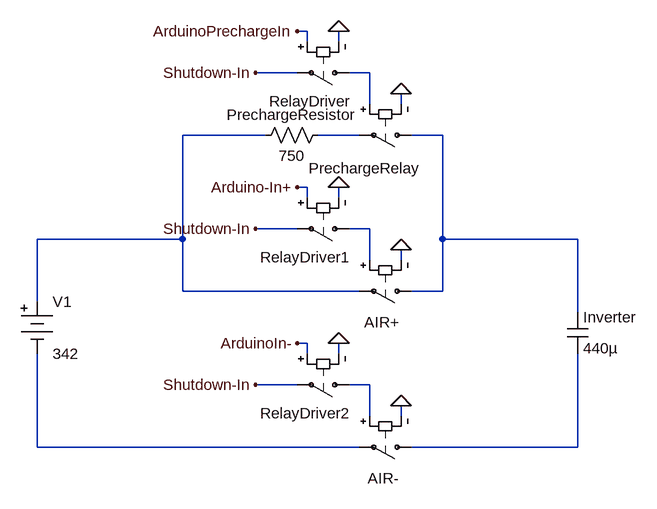
[diagram p0: schematic System Schematic.asc]
System Schematic.asc, the LTspice schematic file:
Version 4
SHEET 1 880 796
WIRE 160 -64 144 -64
WIRE 160 -48 160 -64
WIRE 208 -48 208 -64
WIRE 144 0 80 0
WIRE 256 0 224 0
WIRE 256 48 256 0
WIRE 304 48 304 32
WIRE 96 96 -32 96
WIRE 240 96 176 96
WIRE 368 96 320 96
WIRE 160 176 144 176
WIRE 160 192 160 176
WIRE 208 192 208 176
WIRE 144 240 80 240
WIRE 256 240 224 240
WIRE -32 256 -32 96
WIRE -32 256 -256 256
WIRE 368 256 368 96
WIRE 576 256 368 256
WIRE 256 288 256 240
WIRE 304 288 304 272
WIRE -32 336 -32 256
WIRE 240 336 -32 336
WIRE 368 336 368 256
WIRE 368 336 320 336
WIRE -256 352 -256 256
WIRE 576 368 576 256
WIRE 160 416 144 416
WIRE 160 432 160 416
WIRE 208 432 208 416
WIRE 144 480 80 480
WIRE 256 480 224 480
WIRE 256 528 256 480
WIRE 304 528 304 512
WIRE -256 576 -256 432
WIRE 240 576 -256 576
WIRE 576 576 576 432
WIRE 576 576 320 576
FLAG 144 -64 ArduinoPrechargeIn
FLAG 304 32 0
FLAG 208 -64 0
FLAG 304 272 0
FLAG 80 0 Shutdown-In
FLAG 304 512 0
FLAG 144 176 Arduino-In+
FLAG 208 176 0
FLAG 80 240 Shutdown-In
FLAG 144 416 ArduinoIn-
FLAG 208 416 0
FLAG 80 480 Shutdown-In
SYMBOL cap 560 368 R0
SYMATTR InstName Inverter
SYMATTR Value 440µ
SYMBOL sw 240 0 R90
WINDOW 0 44 13 VRight 2
WINDOW 3 42 43 VRight 2
SYMATTR InstName RelayDriver
SYMATTR Value ""
SYMBOL sw 336 96 R90
WINDOW 0 51 1 VRight 2
WINDOW 3 54 -4 VRight 2
SYMATTR InstName PrechargeRelay
SYMATTR Value ""
SYMBOL res 192 80 R90
WINDOW 0 0 56 VBottom 2
WINDOW 3 32 56 VTop 2
SYMATTR InstName PrechargeResistor
SYMATTR Value 750
SYMBOL sw 336 336 R90
WINDOW 0 48 35 VRight 2
WINDOW 3 57 36 VRight 2
SYMATTR InstName AIR+
SYMATTR Value ""
SYMBOL sw 336 576 R90
WINDOW 0 48 35 VRight 2
WINDOW 3 57 36 VRight 2
SYMATTR InstName AIR-
SYMATTR Value ""
SYMBOL sw 240 240 R90
WINDOW 0 44 13 VRight 2
WINDOW 3 42 43 VRight 2
SYMATTR InstName RelayDriver1
SYMATTR Value ""
SYMBOL sw 240 480 R90
WINDOW 0 44 13 VRight 2
WINDOW 3 42 43 VRight 2
SYMATTR InstName RelayDriver2
SYMATTR Value ""
SYMBOL Misc\\battery -256 336 R0
WINDOW 123 0 0 Left 0
WINDOW 39 0 0 Left 0
SYMATTR InstName V1
SYMATTR Value 342

The netlist it stands for:
* System Schematic.asc
C§Inverter N004 N008 440µ
S§RelayDriver N001 Shutdown-In ArduinoPrechargeIn 0
S§PrechargeRelay N004 N003 N001 0
R§PrechargeResistor N003 N002 750
S§AIR+ N004 N002 N005 0
S§AIR- N008 N007 N006 0
S§RelayDriver1 N005 Shutdown-In Arduino-In+ 0
S§RelayDriver2 N006 Shutdown-In ArduinoIn- 0
V1 N002 N007 342
.backanno
.end